# Altium project NUC973 DEV BOARD 20150401.PrjPcb
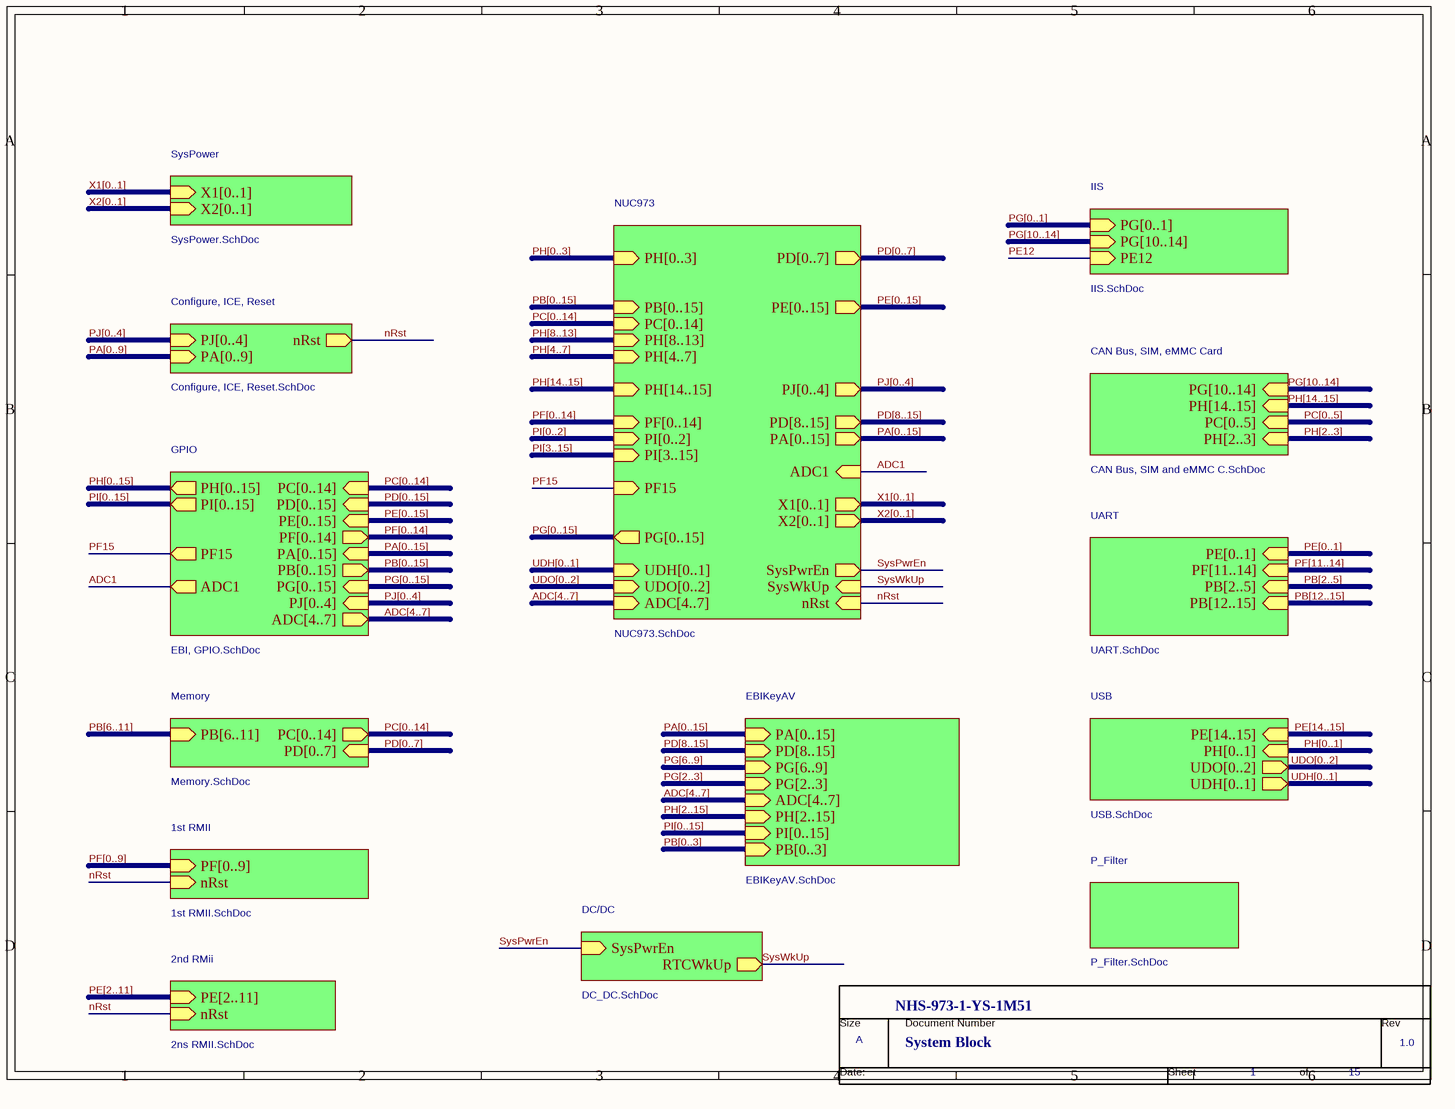
[diagram p0: SysBlock.SchDoc]
9 sheets, 369 parts. Net scope: hierarchical (ports join the sheet entries above them; power ports are global).
Sheets:
  SysBlock.SchDoc
    2nd RMii = 2ns RMII.SchDoc
    Memory = Memory.SchDoc
    USB = USB.SchDoc
    P_Filter = P_Filter.SchDoc
    SysPower = SysPower.SchDoc
    1st RMII = 1st RMII.SchDoc
    GPIO = EBI, GPIO.SchDoc
    IIS = IIS.SchDoc

## Sheet SysBlock.SchDoc
size 220 x 165 mm

### Parts
(Parts that share a designator on the sheet are numbered #1, #2 ... from top to bottom, then left to right.)
*#1  RevCode: 1.0  Page Size: A  Page Number: 1  Page Count: 15  Doc: System Block  OrgName: NHS-973-1-YS-1M51  (hidden comment: TitleBlock0N)  (graphical)

### Sub-sheets
1st RMII = 1st RMII.SchDoc: PF[0..9] (in), nRst (in)
2nd RMii = 2ns RMII.SchDoc: PE[2..11] (in), nRst (in)
CAN Bus, SIM, eMMC Card = CAN Bus, SIM and eMMC C.SchDoc (file not in this document): PG[10..14] (in), PH[14..15] (in), PH[2..3] (in), PC[0..5] (in)
Configure, ICE, Reset = Configure, ICE, Reset.SchDoc (file not in this document): PJ[0..4] (in), nRst (out), PA[0..9] (in)
DC/DC = DC_DC.SchDoc (file not in this document): SysPwrEn (in), RTCWkUp (out)
EBIKeyAV = EBIKeyAV.SchDoc (file not in this document): PA[0..15] (in), PD[8..15] (in), PG[6..9] (in), PG[2..3] (in), ADC[4..7] (in), PH[2..15] (in), PI[0..15] (in), PB[0..3] (in)
GPIO = EBI, GPIO.SchDoc: PC[0..14] (in), PD[0..15] (in), PE[0..15] (in), PF[0..14] (out), PH[0..15] (out), PA[0..15] (in), PB[0..15] (out), PG[0..15] (in), PI[0..15] (out), PJ[0..4] (in), ADC[4..7] (out), PF15 (out), ADC1 (out)
IIS = IIS.SchDoc: PG[0..1] (in), PG[10..14] (in), PE12 (in)
Memory = Memory.SchDoc: PB[6..11] (in), PC[0..14] (out), PD[0..7] (in)
NUC973 = NUC973.SchDoc (file not in this document): PD[0..7] (out), PH[0..3] (in), PE[0..15] (out), X1[0..1] (out), PB[0..15] (in), PC[0..14] (in), PH[8..13] (in), PH[4..7] (in), UDH[0..1] (in), PH[14..15] (in), UDO[0..2] (in), X2[0..1] (out), PF[0..14] (in), PI[0..2] (in), PI[3..15] (in), PJ[0..4] (out), nRst (in), PG[0..15] (out), PD[8..15] (out), PA[0..15] (out), SysWkUp (in), SysPwrEn (out), ADC[4..7] (in), PF15 (in), ADC1 (in)
P_Filter = P_Filter.SchDoc: no entries
SysPower = SysPower.SchDoc: X1[0..1] (in), X2[0..1] (in)
UART = UART.SchDoc (file not in this document): PE[0..1] (in), PF[11..14] (in), PB[2..5] (in), PB[12..15] (in)
USB = USB.SchDoc: PE[14..15] (in), UDO[0..2] (out), UDH[0..1] (out), PH[0..1] (in)

### Nets
ADC1: sheet NUC973/ADC1, sheet GPIO/ADC1
nRst: sheet 2nd RMii/nRst, sheet Configure, ICE, Reset/nRst, sheet NUC973/nRst, sheet 1st RMII/nRst
PE12: sheet IIS/PE12
PF15: sheet NUC973/PF15, sheet GPIO/PF15
SysPwrEn: sheet DC/DC/SysPwrEn, sheet NUC973/SysPwrEn
SysWkUp: sheet DC/DC/RTCWkUp, sheet NUC973/SysWkUp

### Buses and harness runs
bus ADC[4..7] = sheet EBIKeyAV/ADC[4..7]
bus ADC[4..7] = sheet GPIO/ADC[4..7]
bus ADC[4..7] = sheet NUC973/ADC[4..7]
bus PA[0..9] = sheet Configure, ICE, Reset/PA[0..9]
bus PA[0..15] = sheet EBIKeyAV/PA[0..15]
bus PA[0..15] = sheet GPIO/PA[0..15]
bus PA[0..15] = sheet NUC973/PA[0..15]
bus PB[0..3] = sheet EBIKeyAV/PB[0..3]
bus PB[0..15] = sheet GPIO/PB[0..15]
bus PB[0..15] = sheet NUC973/PB[0..15]
bus PB[2..5] = sheet UART/PB[2..5]
bus PB[6..11] = sheet Memory/PB[6..11]
bus PB[12..15] = sheet UART/PB[12..15]
bus PC[0..5] = sheet CAN Bus, SIM, eMMC Card/PC[0..5]
bus PC[0..14] = sheet GPIO/PC[0..14]
bus PC[0..14] = sheet Memory/PC[0..14]
bus PC[0..14] = sheet NUC973/PC[0..14]
bus PD[0..7] = sheet Memory/PD[0..7]
bus PD[0..7] = sheet NUC973/PD[0..7]
bus PD[0..15] = sheet GPIO/PD[0..15]
bus PD[8..15] = sheet EBIKeyAV/PD[8..15]
bus PD[8..15] = sheet NUC973/PD[8..15]
bus PE[0..1] = sheet UART/PE[0..1]
bus PE[0..15] = sheet GPIO/PE[0..15]
bus PE[0..15] = sheet NUC973/PE[0..15]
bus PE[2..11] = sheet 2nd RMii/PE[2..11]
bus PE[14..15] = sheet USB/PE[14..15]
bus PF[0..9] = sheet 1st RMII/PF[0..9]
bus PF[0..14] = sheet GPIO/PF[0..14]
bus PF[0..14] = sheet NUC973/PF[0..14]
bus PF[11..14] = sheet UART/PF[11..14]
bus PG[0..1] = sheet IIS/PG[0..1]
bus PG[0..15] = sheet GPIO/PG[0..15]
bus PG[0..15] = sheet NUC973/PG[0..15]
bus PG[2..3] = sheet EBIKeyAV/PG[2..3]
bus PG[6..9] = sheet EBIKeyAV/PG[6..9]
bus PG[10..14] = sheet CAN Bus, SIM, eMMC Card/PG[10..14]
bus PG[10..14] = sheet IIS/PG[10..14]
bus PH[0..1] = sheet USB/PH[0..1]
bus PH[0..3] = sheet NUC973/PH[0..3]
bus PH[0..15] = sheet GPIO/PH[0..15]
bus PH[2..3] = sheet CAN Bus, SIM, eMMC Card/PH[2..3]
bus PH[2..15] = sheet EBIKeyAV/PH[2..15]
bus PH[4..7] = sheet NUC973/PH[4..7]
bus PH[8..13] = sheet NUC973/PH[8..13]
bus PH[14..15] = sheet CAN Bus, SIM, eMMC Card/PH[14..15]
bus PH[14..15] = sheet NUC973/PH[14..15]
bus PI[0..2] = sheet NUC973/PI[0..2]
bus PI[0..15] = sheet EBIKeyAV/PI[0..15]
bus PI[0..15] = sheet GPIO/PI[0..15]
bus PI[3..15] = sheet NUC973/PI[3..15]
bus PJ[0..4] = sheet Configure, ICE, Reset/PJ[0..4]
bus PJ[0..4] = sheet GPIO/PJ[0..4]
bus PJ[0..4] = sheet NUC973/PJ[0..4]
bus UDH[0..1] = sheet NUC973/UDH[0..1]
bus UDH[0..1] = sheet USB/UDH[0..1]
bus UDO[0..2] = sheet NUC973/UDO[0..2]
bus UDO[0..2] = sheet USB/UDO[0..2]
bus X1[0..1] = sheet NUC973/X1[0..1]
bus X1[0..1] = sheet SysPower/X1[0..1]
bus X2[0..1] = sheet NUC973/X2[0..1]
bus X2[0..1] = sheet SysPower/X2[0..1]

### Notes on the sheet
- (in symbol TitleBlock0N) Size; Document Number; Rev; Date:; Sheet; of

### Library data of the parts
*#1 = TitleBlock0N: Page Create Date: April 25, 1995

## Sheet 2ns RMII.SchDoc
size 220 x 165 mm
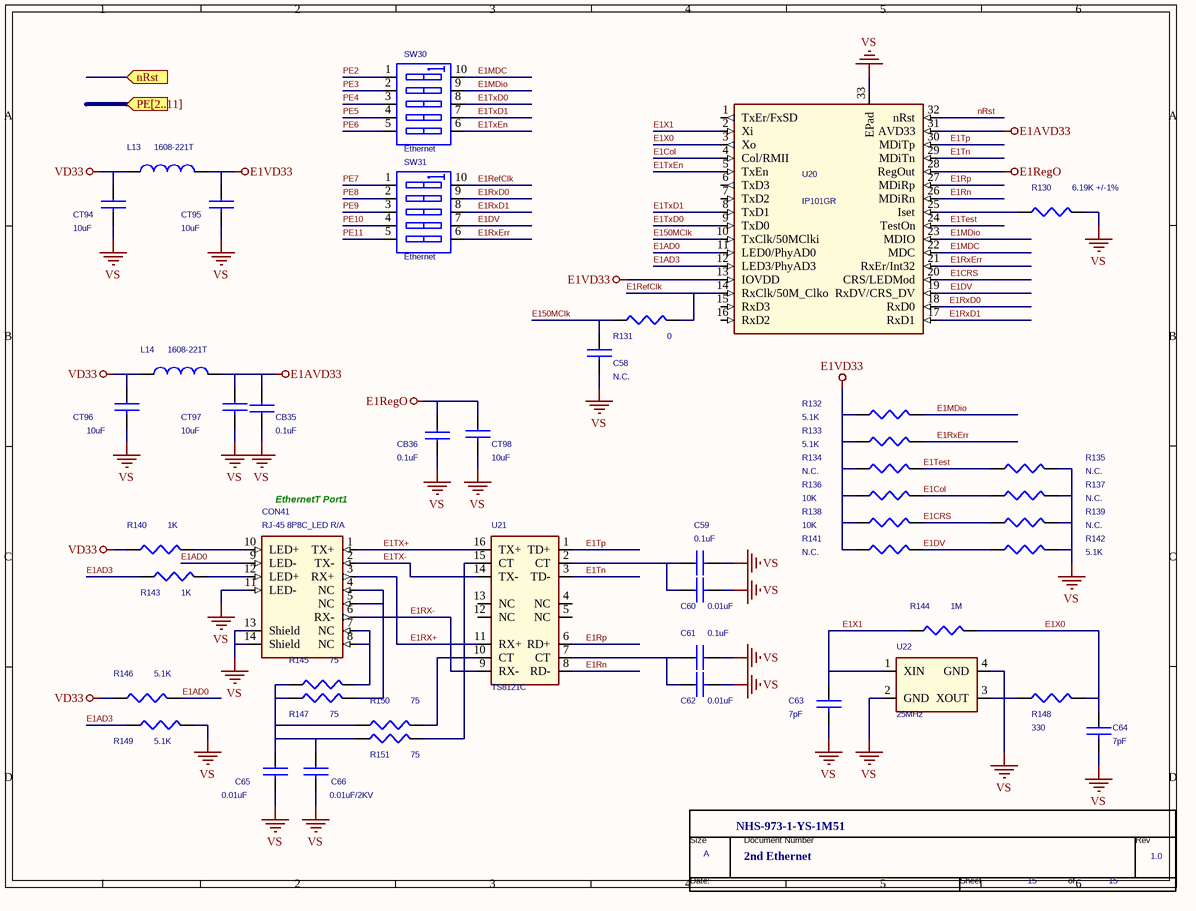
[diagram p1: 2ns RMII.SchDoc]

### Parts
(Parts that share a designator on the sheet are numbered #1, #2 ... from top to bottom, then left to right.)
*#2  RevCode: 1.0  Page Size: A  Page Number: 15  Doc: 2nd Ethernet  OrgName: NHS-973-1-YS-1M51  (hidden comment: TitleBlock0N)  (graphical)
C58  N.C.  [C0603]
C59  0.1uF  [C0603]
C60  0.01uF  [C0603]
C61  0.1uF  [C0603]
C62  0.01uF  [C0603]
C63  7pF  [C0603]
C64  7pF  [C0603]
C65  0.01uF  [C0603]
C66  0.01uF/2KV  [CK05]
CB35  0.1uF  [C0603]
CB36  0.1uF  [C0603]
CON41  RJ-45 8P8C_LED R/A  [RJ45\8P\JA\LED]
CT94  10uF  [C0603]
CT95  10uF  [C0603]
CT96  10uF  [C0603]
CT97  10uF  [C0603]
CT98  10uF  [C0603]
L13  1608-221T  [L0603]
L14  1608-221T  [L0603]
R130  6.19K +/-1%  [R0603]
R131  0  [R0603]
R132  5.1K  [R0603]
R133  5.1K  [R0603]
R134  N.C.  [R0603]
R135  N.C.  [R0603]
R136  10K  [R0603]
R137  N.C.  [R0603]
R138  10K  [R0603]
R139  N.C.  [R0603]
R140  1K  [R0603]
R141  N.C.  [R0603]
R142  5.1K  [R0603]
R143  1K  [R0603]
R144  1M  [R0603]
R145  75  [R0603]
R146  5.1K  [R0603]
R147  75  [R0603]
R148  330  [R0603]
R149  5.1K  [R0603]
R150  75  [R0603]
R151  75  [R0603]
SW30  Ethernet  [DIPSWx5_2.54mm]
SW31  Ethernet  [DIPSWx5_2.54mm]
U20  IP101GR  [QFN32]
U21  TS8121C  [ST6200T]
U22  25MHz  [SOT-143]

### Ports
nRst (in), PE[2..11] (in)

### Nets
E1AVD33: CB35.2 CT97.1 L14.2 U20.31(AVD33)
E1RegO: CB36.2 CT98.1 U20.28(RegOut)
E1VD33: CT95.1 L13.2 R132.2 R133.2 R134.2 R136.2 R138.2 R141.2 U20.13(IOVDD)
VD33: CT94.1 CT96.1 L13.1 L14.1 R140.1 R146.1
VS: C58.2 C59.2 C60.2 C61.2 C62.2 C63.2 C64.2 C65.2 C66.2 CB35.1 CB36.1 CON41.11(LED-) CON41.13(Shield) CON41.14(Shield) CT94.2 CT95.2 CT96.2 CT97.2 CT98.2 R130.1 R135.1 R137.1 R139.1 R142.1 R149.2 U20.33(EPad) U22.2(GND) U22.4(GND)
E1AD0: CON41.9(LED-) R146.2 U20.11(LED0/PhyAD0)
E1AD3: R143.1 R149.1 U20.12(LED3/PhyAD3)
E1Col: R136.1 R137.2 U20.4(Col/RMII)
E1CRS: R138.1 R139.2 U20.20(CRS/LEDMod)
E1DV: R141.1 R142.2 SW31.7(B4) U20.19(RxDV/CRS_DV)
E1MDC: SW30.10(B1) U20.22(MDC)
E1MDio: R132.1 SW30.9(B2) U20.23(MDIO)
E1RefClk: R131.1 SW31.10(B1) U20.14(RxClk/50M_Clko)
E1Rn: U20.26(MDiRn) U21.8(RD-)
E1Rp: U20.27(MDiRp) U21.6(RD+)
E1RX+: CON41.3(RX+) U21.11(RX+)
E1RX-: CON41.6(RX-) U21.9(RX-)
E1RxD0: SW31.9(B2) U20.18(RxD0)
E1RxD1: SW31.8(B3) U20.17(RxD1)
E1RxErr: R133.1 SW31.6(B5) U20.21(RxEr/Int32)
E1Test: R134.1 R135.2 U20.24(TestOn)
E1Tn: U20.29(MDiTn) U21.3(TD-)
E1Tp: U20.30(MDiTp) U21.1(TD+)
E1TX+: CON41.1(TX+) U21.16(TX+)
E1TX-: CON41.2(TX-) U21.14(TX-)
E1TxD0: SW30.8(B3) U20.9(TxD0)
E1TxD1: SW30.7(B4) U20.8(TxD1)
E1TxEn: SW30.6(B5) U20.5(TxEn)
E1X0: C64.1 R144.1 R148.2 U20.3(Xo)
E1X1: C63.1 R144.2 U20.2(Xi) U22.1(XIN)
E150MClk: C58.1 R131.2 U20.10(TxClk/50MClki)
nRst: U20.32(nRst)
PE2: SW30.1(A1)
PE3: SW30.2(A2)
PE4: SW30.3(A3)
PE5: SW30.4(A4)
PE6: SW30.5(A5)
PE7: SW31.1(A1)
PE8: SW31.2(A2)
PE9: SW31.3(A3)
PE10: SW31.4(A4)
PE11: SW31.5(A5)
NetC59_1: C59.1 C60.1 U21.2(CT)
NetC61_1: C61.1 C62.1 U21.7(CT)
NetC65_1: C65.1 C66.1 R145.1 R147.1 R150.1 R151.1
NetCON41_4: CON41.4(NC) CON41.5(NC) R147.2
NetCON41_7: CON41.7(NC) CON41.8(NC) R145.2
NetCON41_10: CON41.10(LED+) R140.2
NetCON41_12: CON41.12(LED+) R143.2
NetR130_2: R130.2 U20.25(Iset)
NetR148_1: R148.1 U22.3(XOUT)
NetR150_2: R150.2 U21.10(CT)
NetR151_2: R151.2 U21.15(CT)

Not connected (* = marked no-connect by the designer): U20 1(TxEr/FxSD) 6(TxD3) 7(TxD2) 15(RxD3) 16(RxD2); U21 4(NC) 5(NC) 12(NC) 13(NC)

### Notes on the sheet
- (near CON41) EthernetT Port1
- (in symbol TitleBlock0N) Size; Document Number; Rev; Date:; Sheet; of

### Library data of the parts
C58-C66 CB35 CB36 CT94-CT98 = CAP NP
CON41 = RJ45_SHLD_0
L13 L14 = INDUCTOR
R130-R151 = R
SW30 SW31 = SW DIP-5_0
U20 = IP101GA_0
U21 = PE-68515_1
U22 = Crystal_SMD_2: Vendor: Aurum
*#2 = TitleBlock0N: Page Create Date: April 25, 1995; Page Count: 15

## Sheet Memory.SchDoc
size 220 x 165 mm
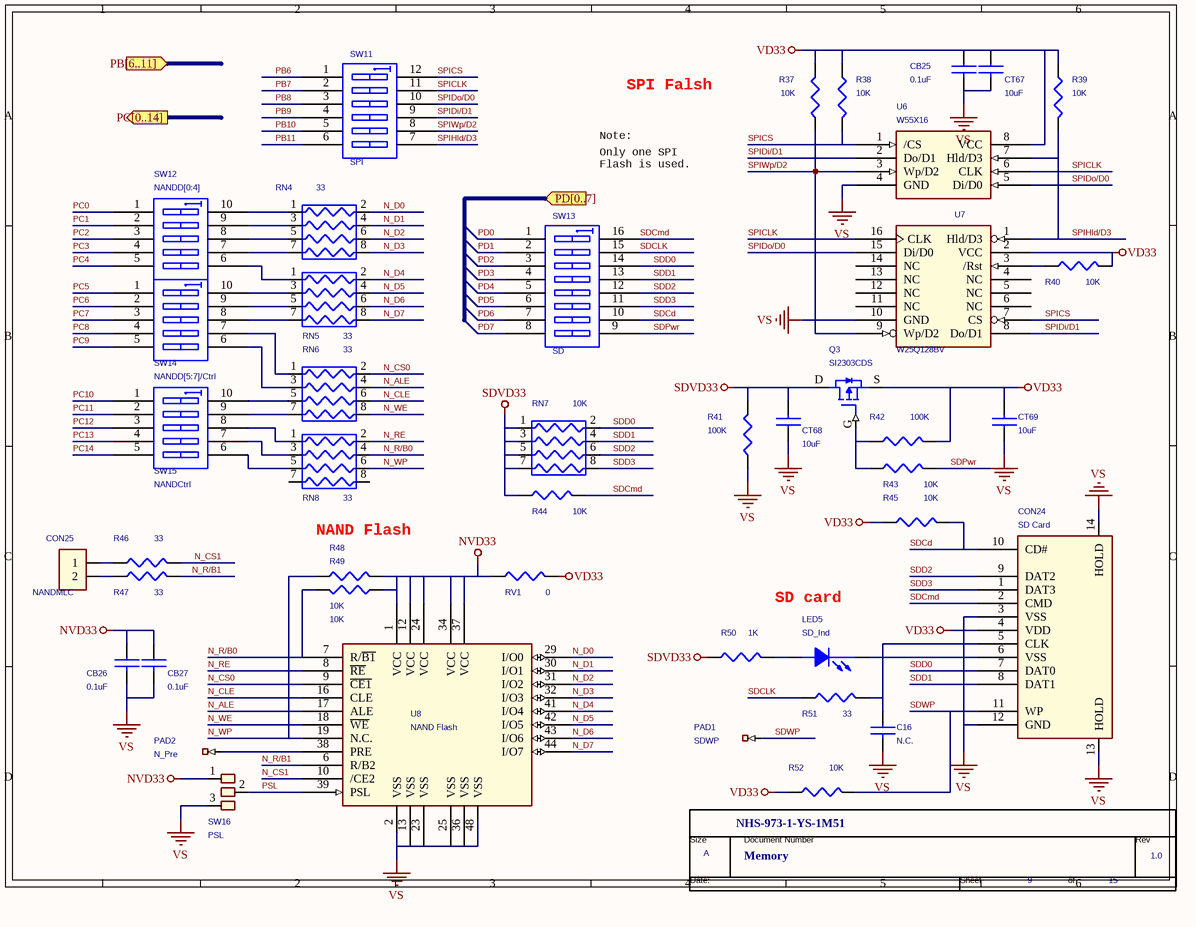
[diagram p2: Memory.SchDoc]

### Parts
(Parts that share a designator on the sheet are numbered #1, #2 ... from top to bottom, then left to right.)
*#3  RevCode: 1.0  Page Size: A  Page Number: 9  Page Count: 15  Doc: Memory  OrgName: NHS-973-1-YS-1M51  (hidden comment: TitleBlock0N)  (graphical)
C16  N.C.  [C0603]
CB25  0.1uF  [C0603]
CB26  0.1uF  [C0603]
CB27  0.1uF  [C0603]
CON24  SD Card  [AXA2R63061]
CON25  NANDMLC  [Header_2x1_2.54mm]
CT67  10uF  [C0603]
CT68  10uF  [C0603]
CT69  10uF  [C0603]
LED5  SD_Ind  [LED_0603]
PAD1  SDWP  [1PAD 1.25x1.25mm]
PAD2  N_Pre  [1PAD 1.25x1.25mm]
Q3  SI2303CDS  [SOT-23]
R37  10K  [R0603]
R38  10K  [R0603]
R39  10K  [R0603]
R40  10K  [R0603]
R41  100K  [R0603]
R42  100K  [R0603]
R43  10K  [R0603]
R44  10K  [R0603]
R45  10K  [R0603]
R46  33  [R0603]
R47  33  [R0603]
R48  10K  [R0603]
R49  10K  [R0603]
R50  1K  [R0603]
R51  33  [R0603]
R52  10K  [R0603]
RN4  33  [8P4RA]
RN5  33  [8P4RA]
RN6  33  [8P4RA]
RN7  10K  [8P4RA]
RN8  33  [8P4RA]
RV1  0  [R0603]
SW11  SPI  [DIPSWx6_2.54mm]
SW12  NANDD[0:4]  [DIPSWx5_2.54mm]
SW13  SD  [DIPSWx8_2.54mm]
SW14  NANDD[5:7]/Ctrl  [DIPSWx5_2.54mm]
SW15  NANDCtrl  [DIPSWx5_2.54mm]
SW16  PSL  [3P-1.2mm]
U6  W55X16  [8-pin SOIC 150mil]
U7  W25Q128BV  [SOIC16_300]
U8  NAND Flash  [SOP48-0.5mm]

### Ports
PB[6..11] (in), PC[0..14] (out), PD[0..7] (in)

### Nets
NVD33: CB26.1 CB27.1 R48.2 R49.2 RV1.2 SW16.1(\) U8.1(VCC) U8.12(VCC) U8.24(VCC) U8.34(VCC) U8.37(VCC)
SDVD33: CT68.2 Q3.D(DRAIN) R41.2 R44.2 R50.1 RN7.1(R1) RN7.3(R2) RN7.5(R3) RN7.7(R4)
VD33: CB25.1 CON24.4(VDD) CT67.1 CT69.2 Q3.S(SOURCE) R37.2 R38.2 R39.2 R40.1 R42.2 R45.2 R52.2 RV1.1 U6.8(VCC) U7.2(VCC)
VS: C16.2 CB25.2 CB26.2 CB27.2 CON24.3(VSS) CON24.12(GND) CON24.13(HOLD) CON24.14(HOLD) CT67.2 CT68.1 CT69.1 R41.1 SW16.3(\) U6.4(GND) U7.10(GND) U8.2(VSS) U8.13(VSS) U8.23(VSS) U8.25(VSS) U8.36(VSS) U8.48(VSS)
N_ALE: RN6.4(R2) U8.17(ALE)
N_CLE: RN6.6(R3) U8.16(CLE)
N_CS0: RN6.2(R1) U8.9(~{CE1})
N_CS1: R46.2 U8.10(/CE2)
N_D0: RN4.2(R1) U8.29(I/O0)
N_D1: RN4.4(R2) U8.30(I/O1)
N_D2: RN4.6(R3) U8.31(I/O2)
N_D3: RN4.8(R4) U8.32(I/O3)
N_D4: RN5.2(R1) U8.41(I/O4)
N_D5: RN5.4(R2) U8.42(I/O5)
N_D6: RN5.6(R3) U8.43(I/O6)
N_D7: RN5.8(R4) U8.44(I/O7)
N_R/B0: R49.1 RN8.4(R2) U8.7(R/~{B1})
N_R/B1: R47.2 U8.6(R/B2)
N_RE: RN8.2(R1) U8.8(~{RE})
N_WE: RN6.8(R4) U8.18(~{WE})
N_WP: R48.1 RN8.6(R3) U8.19(N.C.)
PB6: SW11.1(A1)
PB7: SW11.2(A2)
PB8: SW11.3(A3)
PB9: SW11.4(A4)
PB10: SW11.5(A5)
PB11: SW11.6(A6)
PC0: SW12.1(A1)
PC1: SW12.2(A2)
PC2: SW12.3(A3)
PC3: SW12.4(A4)
PC4: SW12.5(A5)
PC5: SW14.1(A1)
PC6: SW14.2(A2)
PC7: SW14.3(A3)
PC8: SW14.4(A4)
PC9: SW14.5(A5)
PC10: SW15.1(A1)
PC11: SW15.2(A2)
PC12: SW15.3(A3)
PC13: SW15.4(A4)
PC14: SW15.5(A5)
PD0: SW13.1(A1)
PD1: SW13.2(A2)
PD2: SW13.3(A3)
PD3: SW13.4(A4)
PD4: SW13.5(A5)
PD5: SW13.6(A6)
PD6: SW13.7(A7)
PD7: SW13.8(A8)
PSL: SW16.2(\) U8.39(PSL)
SDCd: CON24.10(CD#) R45.1 SW13.10(B7)
SDCLK: R51.2 SW13.15(B2)
SDCmd: CON24.2(CMD) R44.1 SW13.16(B1)
SDD0: CON24.7(DAT0) RN7.2(R1) SW13.14(B3)
SDD1: CON24.8(DAT1) RN7.4(R2) SW13.13(B4)
SDD2: CON24.9(DAT2) RN7.6(R3) SW13.12(B5)
SDD3: CON24.1(DAT3) RN7.8(R4) SW13.11(B6)
SDPwr: R43.1 SW13.9(B8)
SDWP: CON24.11(WP) PAD1.\ R52.1
SPICLK: SW11.11(B2) U6.6(CLK) U7.16(CLK)
SPICS: R38.1 SW11.12(B1) U6.1(/CS) U7.7(CS)
SPIDi/D1: SW11.9(B4) U6.2(Do/D1) U7.8(Do/D1)
SPIDo/D0: SW11.10(B3) U6.5(Di/D0) U7.15(Di/D0)
SPIHld/D3: R39.1 SW11.7(B6) U6.7(Hld/D3) U7.1(Hld/D3)
SPIWp/D2: R37.1 SW11.8(B5) U6.3(Wp/D2) U7.9(Wp/D2)
NetC16_1: C16.1 CON24.5(CLK) R51.1
NetCON24_6: CON24.6(VSS) LED5.2(CATHODE)
NetCON25_1: CON25.1 R46.1
NetCON25_2: CON25.2 R47.1
NetLED5_1: LED5.1(ANODE) R50.2
NetPAD2~{_}: PAD2.\ U8.38(PRE)
NetQ3_G: Q3.G(GATE) R42.1 R43.2
NetR40_2: R40.2 U7.3(/Rst)
NetRN4_1: RN4.1(R1) SW12.10(B1)
NetRN4_3: RN4.3(R2) SW12.9(B2)
NetRN4_5: RN4.5(R3) SW12.8(B3)
NetRN4_7: RN4.7(R4) SW12.7(B4)
NetRN5_1: RN5.1(R1) SW12.6(B5)
NetRN5_3: RN5.3(R2) SW14.10(B1)
NetRN5_5: RN5.5(R3) SW14.9(B2)
NetRN5_7: RN5.7(R4) SW14.8(B3)
NetRN6_1: RN6.1(R1) SW14.7(B4)
NetRN6_3: RN6.3(R2) SW14.6(B5)
NetRN6_5: RN6.5(R3) SW15.10(B1)
NetRN6_7: RN6.7(R4) SW15.9(B2)
NetRN8_1: RN8.1(R1) SW15.8(B3)
NetRN8_3: RN8.3(R2) SW15.7(B4)
NetRN8_5: RN8.5(R3) SW15.6(B5)

Not connected (* = marked no-connect by the designer): RN8 7(R4) 8(R4); U7 4(NC) 5(NC) 6(NC) 11(NC) 12(NC) 13(NC) 14(NC)

### Notes on the sheet
- SPI Falsh
- Only one SPI
  Flash is used.
- Note:
- NAND Flash
- SD card
- (in symbol TitleBlock0N) Size; Document Number; Rev; Date:; Sheet; of

### Library data of the parts
C16 CB25-CB27 CT67-CT69 = CAP NP
CON24 = AXA2R63061_1
CON25 = CON2
LED5 = LED
PAD1 PAD2 = 1PAD
Q3 = SI2303CDS_1
R37-R52 RV1 = R
RN4-RN8 = R-PACK8_0: Package: 8P4RA
SW11 = SW DIP-6
SW12 SW14 SW15 = SW DIP-5
SW13 = SW DIP-8
SW16 = SW-3PAD2
U6 = W55X10_2
U7 = W25Q128BV_4
U8 = NAND 4-8G_0
*#3 = TitleBlock0N: Page Create Date: April 25, 1995

## Sheet USB.SchDoc
size 220 x 165 mm
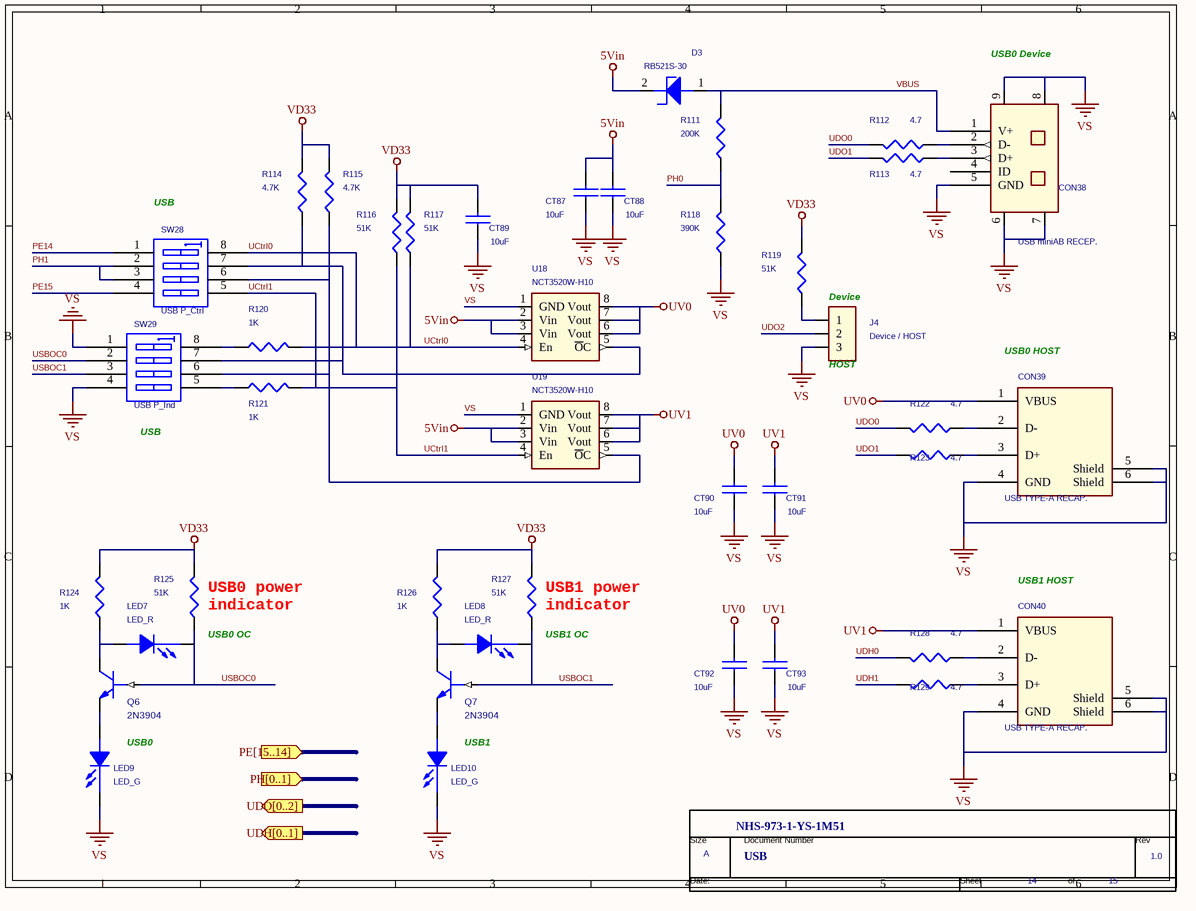
[diagram p3: USB.SchDoc]

### Parts
(Parts that share a designator on the sheet are numbered #1, #2 ... from top to bottom, then left to right.)
*#4  RevCode: 1.0  Page Size: A  Page Number: 14  Page Count: 15  Doc: USB  OrgName: NHS-973-1-YS-1M51  (hidden comment: TitleBlock0N)  (graphical)
CON38  USB miniAB RECEP.  [9]
CON39  USB TYPE-A RECAP.  [USB4P]
CON40  USB TYPE-A RECAP.  [USB4P]
CT87  10uF  [C0603]
CT88  10uF  [C0603]
CT89  10uF  [C0603]
CT90  10uF  [C0603]
CT91  10uF  [C0603]
CT92  10uF  [C0603]
CT93  10uF  [C0603]
D3  RB521S-30  [SOD-523]
J4  Device / HOST  [Header_3x1_2.54mm]
LED7  LED_R  [LED_0603]
LED8  LED_R  [LED_0603]
LED9  LED_G  [LED_0603]
LED10  LED_G  [LED_0603]
Q6  2N3904  [SOT23-BEC]
Q7  2N3904  [SOT23-BEC]
R111  200K  [R0603]
R112  4.7  [R0603]
R113  4.7  [R0603]
R114  4.7K  [R0603]
R115  4.7K  [R0603]
R116  51K  [R0603]
R117  51K  [R0603]
R118  390K  [R0603]
R119  51K  [R0603]
R120  1K  [R0603]
R121  1K  [R0603]
R122  4.7  [R0603]
R123  4.7  [R0603]
R124  1K  [R0603]
R125  51K  [R0603]
R126  1K  [R0603]
R127  51K  [R0603]
R128  4.7  [R0603]
R129  4.7  [R0603]
SW28  USB P_Ctrl  [DIPSWx4_2.54mm]
SW29  USB P_Ind  [DIPSWx4_2.54mm]
U18  NCT3520W-H10  [MSOP-8]
U19  NCT3520W-H10  [MSOP-8]

### Ports
PE[15..14] (in), PH[0..1] (in), UDH[0..1] (out), UDO[0..2] (out)

### Nets
5Vin: CT87.2 CT88.2 D3.2 U18.2(Vin) U18.3(Vin) U19.2(Vin) U19.3(Vin)
UV0: CON39.1(VBUS) CT90.2 CT92.2 U18.6(Vout) U18.7(Vout) U18.8(Vout)
UV1: CON40.1(VBUS) CT91.2 CT93.2 U19.6(Vout) U19.7(Vout) U19.8(Vout)
VD33: CT89.2 R114.2 R115.2 R116.2 R117.2 R119.2 R124.2 R125.2 R126.2 R127.2
VS: CON38.5(GND) CON38.6(\) CON38.7(\) CON38.8(\) CON38.9(\) CON39.4(GND) CON39.5(Shield) CON39.6(Shield) CON40.4(GND) CON40.5(Shield) CON40.6(Shield) CT87.1 CT88.1 CT89.1 CT90.1 CT91.1 CT92.1 CT93.1 J4.3 LED9.2(CATHODE) LED10.2(CATHODE) R118.1 SW29.1(A1) SW29.4(A4) U18.1(GND) U19.1(GND)
PE14: SW28.1(A1)
PE15: SW28.4(A4)
PH0: R111.1 R118.2
PH1: SW28.2(A2) SW28.3(A3)
UCtrl0: R117.1 R120.1 SW28.8(B1) U18.4(En)
UCtrl1: R116.1 R121.1 SW28.5(B4) U19.4(En)
UDH0: R128.2
UDH1: R129.2
UDO0: R112.2 R122.2
UDO1: R113.2 R123.2
UDO2: J4.2
USBOC0: LED7.2(CATHODE) Q6.B R125.1 SW29.2(A2)
USBOC1: LED8.2(CATHODE) Q7.B R127.1 SW29.3(A3)
VBUS: CON38.1(V+) D3.1 R111.2
NetCON38_2: CON38.2(D-) R112.1
NetCON38_3: CON38.3(D+) R113.1
NetCON39_2: CON39.2(D-) R122.1
NetCON39_3: CON39.3(D+) R123.1
NetCON40_2: CON40.2(D-) R128.1
NetCON40_3: CON40.3(D+) R129.1
NetJ4_1: J4.1 R119.1
NetLED7_1: LED7.1(ANODE) Q6.C R124.1
NetLED8_1: LED8.1(ANODE) Q7.C R126.1
NetLED9_1: LED9.1(ANODE) Q6.E
NetLED10_1: LED10.1(ANODE) Q7.E
NetR114_1: R114.1 SW28.7(B2) SW29.7(B2) U18.5(~{O}C)
NetR115_1: R115.1 SW28.6(B3) SW29.6(B3) U19.5(~{O}C)
NetR120_2: R120.2 SW29.8(B1)
NetR121_2: R121.2 SW29.5(B4)

Not connected (* = marked no-connect by the designer): CON38 4(ID)

### Notes on the sheet
- (near CON38) USB0 Device
- (near SW28) USB
- Device
- (near J4) HOST
- (near CON39) USB0 HOST
- (near SW29) USB
- (near R125) USB0 power
  indicator
- (near R127) USB1 power
  indicator
- USB0 OC
- USB1 OC
- (near CON40) USB1 HOST
- USB0
- USB1
- (in symbol TitleBlock0N) Size; Document Number; Rev; Date:; Sheet; of

### Library data of the parts
CON38 = USB Type B_0
CON39 CON40 = USB type_A connector
CT87-CT93 = CAP NP
D3 = ZENAR_0: Package: D
J4 = CON3
LED7-LED10 = LED
Q6 Q7 = NPN_1
R111-R129 = R
SW28 = SW DIP-4_4
SW29 = SW DIP-4
*#4 = TitleBlock0N: Page Create Date: April 25, 1995

## Sheet P_Filter.SchDoc
size 220 x 165 mm
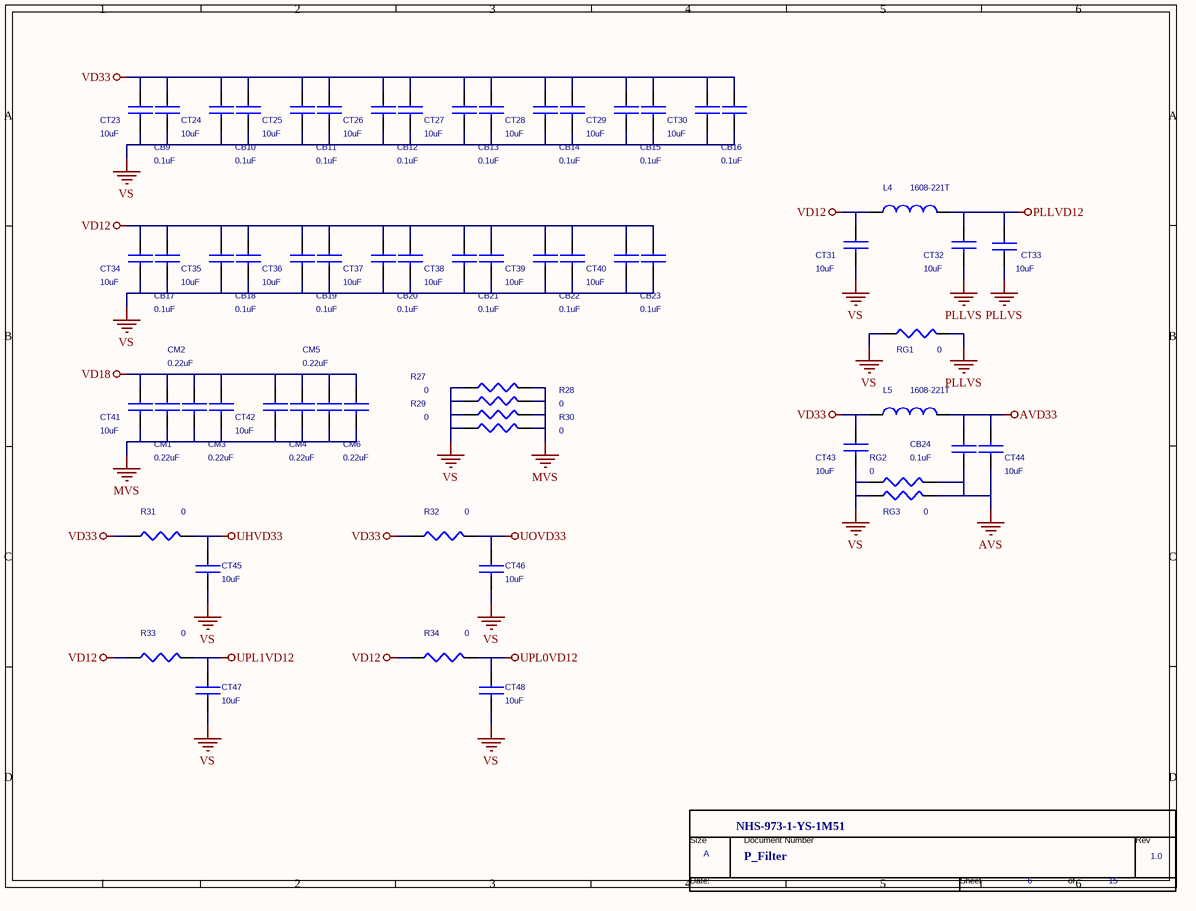
[diagram p4: P_Filter.SchDoc]

### Parts
(Parts that share a designator on the sheet are numbered #1, #2 ... from top to bottom, then left to right.)
*#5  RevCode: 1.0  Page Size: A  Page Number: 6  Page Count: 15  Doc: P_Filter  OrgName: NHS-973-1-YS-1M51  (hidden comment: TitleBlock0N)  (graphical)
CB9  0.1uF  [C0603]
CB10  0.1uF  [C0603]
CB11  0.1uF  [C0603]
CB12  0.1uF  [C0603]
CB13  0.1uF  [C0603]
CB14  0.1uF  [C0603]
CB15  0.1uF  [C0603]
CB16  0.1uF  [C0603]
CB17  0.1uF  [C0603]
CB18  0.1uF  [C0603]
CB19  0.1uF  [C0603]
CB20  0.1uF  [C0603]
CB21  0.1uF  [C0603]
CB22  0.1uF  [C0603]
CB23  0.1uF  [C0603]
CB24  0.1uF  [C0603]
CM1  0.22uF  [C0603]
CM2  0.22uF  [C0603]
CM3  0.22uF  [C0603]
CM4  0.22uF  [C0603]
CM5  0.22uF  [C0603]
CM6  0.22uF  [C0603]
CT23  10uF  [C0603]
CT24  10uF  [C0603]
CT25  10uF  [C0603]
CT26  10uF  [C0603]
CT27  10uF  [C0603]
CT28  10uF  [C0603]
CT29  10uF  [C0603]
CT30  10uF  [C0603]
CT31  10uF  [C0603]
CT32  10uF  [C0603]
CT33  10uF  [C0603]
CT34  10uF  [C0603]
CT35  10uF  [C0603]
CT36  10uF  [C0603]
CT37  10uF  [C0603]
CT38  10uF  [C0603]
CT39  10uF  [C0603]
CT40  10uF  [C0603]
CT41  10uF  [C0603]
CT42  10uF  [C0603]
CT43  10uF  [C0603]
CT44  10uF  [C0603]
CT45  10uF  [C0603]
CT46  10uF  [C0603]
CT47  10uF  [C0603]
CT48  10uF  [C0603]
L4  1608-221T  [L0603]
L5  1608-221T  [L0603]
R27  0  [R0603]
R28  0  [R0603]
R29  0  [R0603]
R30  0  [R0603]
R31  0  [R0603]
R32  0  [R0603]
R33  0  [R0603]
R34  0  [R0603]
RG1  0  [R0603]
RG2  0  [R0603]
RG3  0  [R0603]

### Nets
AVD33: CB24.2 CT44.2 L5.2
AVS: CB24.1 CT44.1 RG2.2 RG3.2
MVS: CM1.2 CM2.2 CM3.2 CM4.2 CM5.2 CM6.2 CT41.2 CT42.2 R27.1 R28.1 R29.1 R30.1
PLLVD12: CT32.1 CT33.2 L4.2
PLLVS: CT32.2 CT33.1 RG1.2
UHVD33: CT45.1 R31.1
UOVD33: CT46.1 R32.1
UPL0VD12: CT48.1 R34.1
UPL1VD12: CT47.1 R33.1
VD12: CB17.1 CB18.1 CB19.1 CB20.1 CB21.1 CB22.1 CB23.1 CT31.1 CT34.1 CT35.1 CT36.1 CT37.1 CT38.1 CT39.1 CT40.1 L4.1 R33.2 R34.2
VD18: CM1.1 CM2.1 CM3.1 CM4.1 CM5.1 CM6.1 CT41.1 CT42.1
VD33: CB9.1 CB10.1 CB11.1 CB12.1 CB13.1 CB14.1 CB15.1 CB16.1 CT23.1 CT24.1 CT25.1 CT26.1 CT27.1 CT28.1 CT29.1 CT30.1 CT43.1 L5.1 R31.2 R32.2
VS: CB9.2 CB10.2 CB11.2 CB12.2 CB13.2 CB14.2 CB15.2 CB16.2 CB17.2 CB18.2 CB19.2 CB20.2 CB21.2 CB22.2 CB23.2 CT23.2 CT24.2 CT25.2 CT26.2 CT27.2 CT28.2 CT29.2 CT30.2 CT31.2 CT34.2 CT35.2 CT36.2 CT37.2 CT38.2 CT39.2 CT40.2 CT43.2 CT45.2 CT46.2 CT47.2 CT48.2 R27.2 R28.2 R29.2 R30.2 RG1.1 RG2.1 RG3.1

### Notes on the sheet
- (in symbol TitleBlock0N) Size; Document Number; Rev; Date:; Sheet; of

### Library data of the parts
CB9-CB24 CM1-CM6 CT23-CT48 = CAP NP
L4 L5 = INDUCTOR
R27-R34 RG1-RG3 = R
*#5 = TitleBlock0N: Page Create Date: April 25, 1995

## Sheet SysPower.SchDoc
size 220 x 165 mm
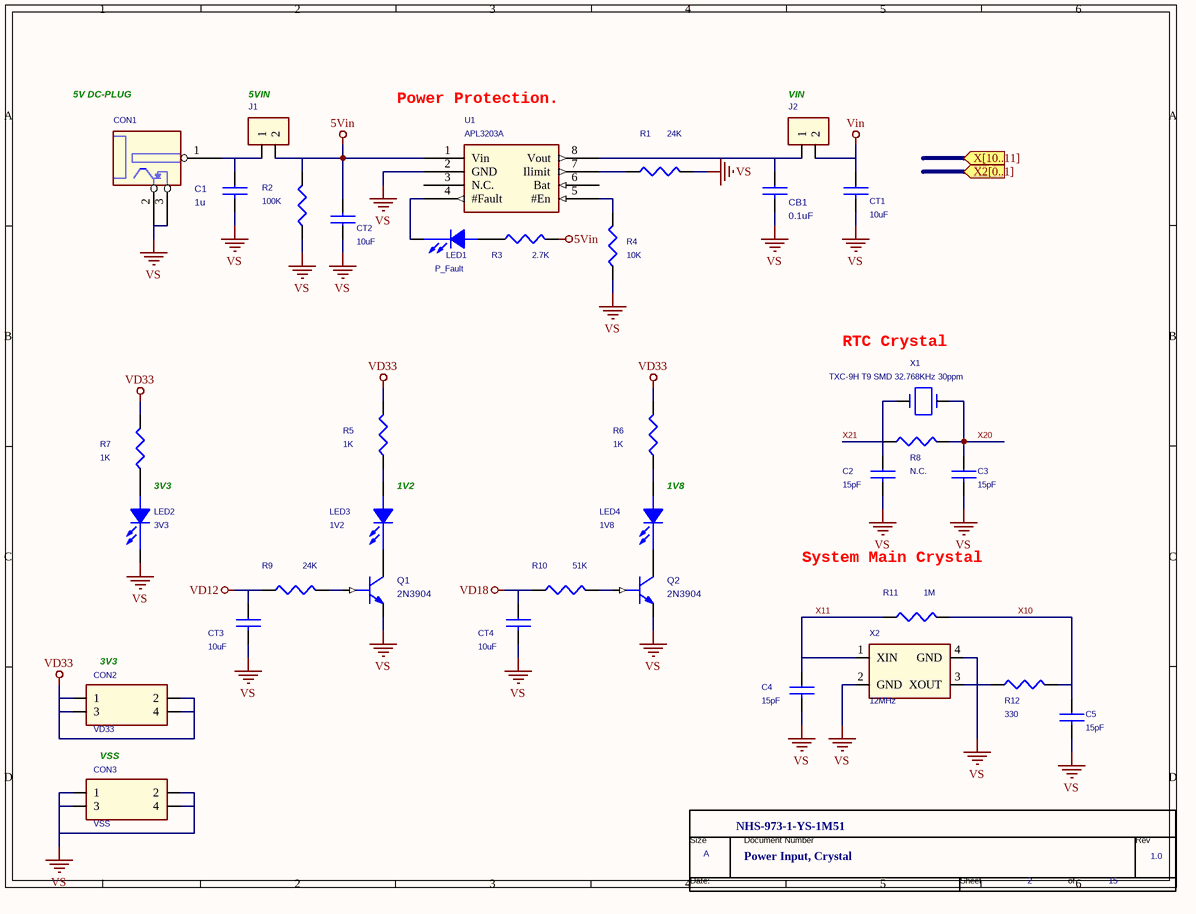
[diagram p5: SysPower.SchDoc]

### Parts
(Parts that share a designator on the sheet are numbered #1, #2 ... from top to bottom, then left to right.)
*#6  RevCode: 1.0  Page Size: A  Page Number: 2  Page Count: 15  Doc: Power Input, Crystal  OrgName: NHS-973-1-YS-1M51  (hidden comment: TitleBlock0N)  (graphical)
C1  1u  [C0603]
C2  15pF  [C0603]
C3  15pF  [C0603]
C4  15pF  [C0603]
C5  15pF  [C0603]
CB1  0.1uF  [C0603]
CON1  DC-PLUG  [3]  (value not drawn)
CON2  VD33  [Header_2x2_2.54mm]
CON3  VSS  [Header_2x2_2.54mm]
CT1  10uF  [C0603]
CT2  10uF  [C0603]
CT3  10uF  [C0603]
CT4  10uF  [C0603]
J1  5Vin  [Header_2x1_2.54mm]  (value not drawn)
J2  Vin  [Header_2x1_2.54mm]  (value not drawn)
LED1  P_Fault  [LED_0603]
LED2  3V3  [LED_0603]
LED3  1V2  [LED_0603]
LED4  1V8  [LED_0603]
Q1  2N3904  [SOT23-BEC]
Q2  2N3904  [SOT23-BEC]
R1  24K  [R0603]
R2  100K  [R0603]
R3  2.7K  [R0603]
R4  10K  [R0603]
R5  1K  [R0603]
R6  1K  [R0603]
R7  1K  [R0603]
R8  N.C.  [R0603]
R9  24K  [R0603]
R10  51K  [R0603]
R11  1M  [R0603]
R12  330  [R0603]
U1  APL3203A  [TDFN2x2-8]
X1  TXC-9H T9 SMD 32.768KHz 30ppm  [XTAL_2P/1.5mm]
X2  12MHz  [TXC7m-3.2x2.5mm]

### Ports
X2[0..1] (in), X[10..11] (in)

### Nets
5Vin: CT2.2 J1.2 R2.2 R3.2 U1.1(Vin)
VD12: CT3.1 R9.2
VD18: CT4.1 R10.2
VD33: CON2.1 CON2.2 CON2.3 CON2.4 R5.2 R6.2 R7.2
Vin: CT1.1 J2.2
VS: C1.2 C2.2 C3.2 C4.2 C5.2 CB1.2 CON1.2 CON1.3 CON3.1 CON3.2 CON3.3 CON3.4 CT1.2 CT2.1 CT3.2 CT4.2 LED2.2(CATHODE) Q1.E Q2.E R1.1 R2.1 R4.2 U1.2(GND) X2.2(GND) X2.4(GND)
X10: C5.1 R11.1 R12.2
X11: C4.1 R11.2 X2.1(XIN)
X20: C3.1 R8.1 X1.1
X21: C2.1 R8.2 X1.2
NetC1_1: C1.1 CON1.1 J1.1
NetCB1_1: CB1.1 J2.1 U1.8(Vout)
NetLED1_1: LED1.1(ANODE) R3.1
NetLED1_2: LED1.2(CATHODE) U1.4(#Fault)
NetLED2_1: LED2.1(ANODE) R7.1
NetLED3_1: LED3.1(ANODE) R5.1
NetLED3_2: LED3.2(CATHODE) Q1.C
NetLED4_1: LED4.1(ANODE) R6.1
NetLED4_2: LED4.2(CATHODE) Q2.C
NetQ1_B: Q1.B R9.1
NetQ2_B: Q2.B R10.1
NetR1_2: R1.2 U1.7(Ilimit)
NetR4_1: R4.1 U1.5(#En)
NetR12_1: R12.1 X2.3(XOUT)

Not connected (* = marked no-connect by the designer): U1 3(N.C.) 6(Bat)

### Notes on the sheet
- 5V DC-PLUG
- (near J1) 5VIN
- (near U1) Power Protection.
- (near J2) VIN
- (near X1) RTC Crystal
- 3V3
- (near LED3) 1V2
- (near LED4) 1V8
- System Main Crystal
- (near CON2) 3V3
- VSS
- (in symbol TitleBlock0N) Size; Document Number; Rev; Date:; Sheet; of

### Library data of the parts
C1-C5 CB1 CT1-CT4 = CAP NP
CON1 = Power Jack
CON2 CON3 = CON4A
J1 J2 = CON2
LED1-LED4 = LED
Q1 Q2 = NPN_1
R1-R12 = R
U1 = APL3203A_1
X1 = MA306/SM_2: Vendor: TXC
X2 = Crystal_SMD_2
*#6 = TitleBlock0N: Page Create Date: April 25, 1995

## Sheet 1st RMII.SchDoc
size 220 x 165 mm
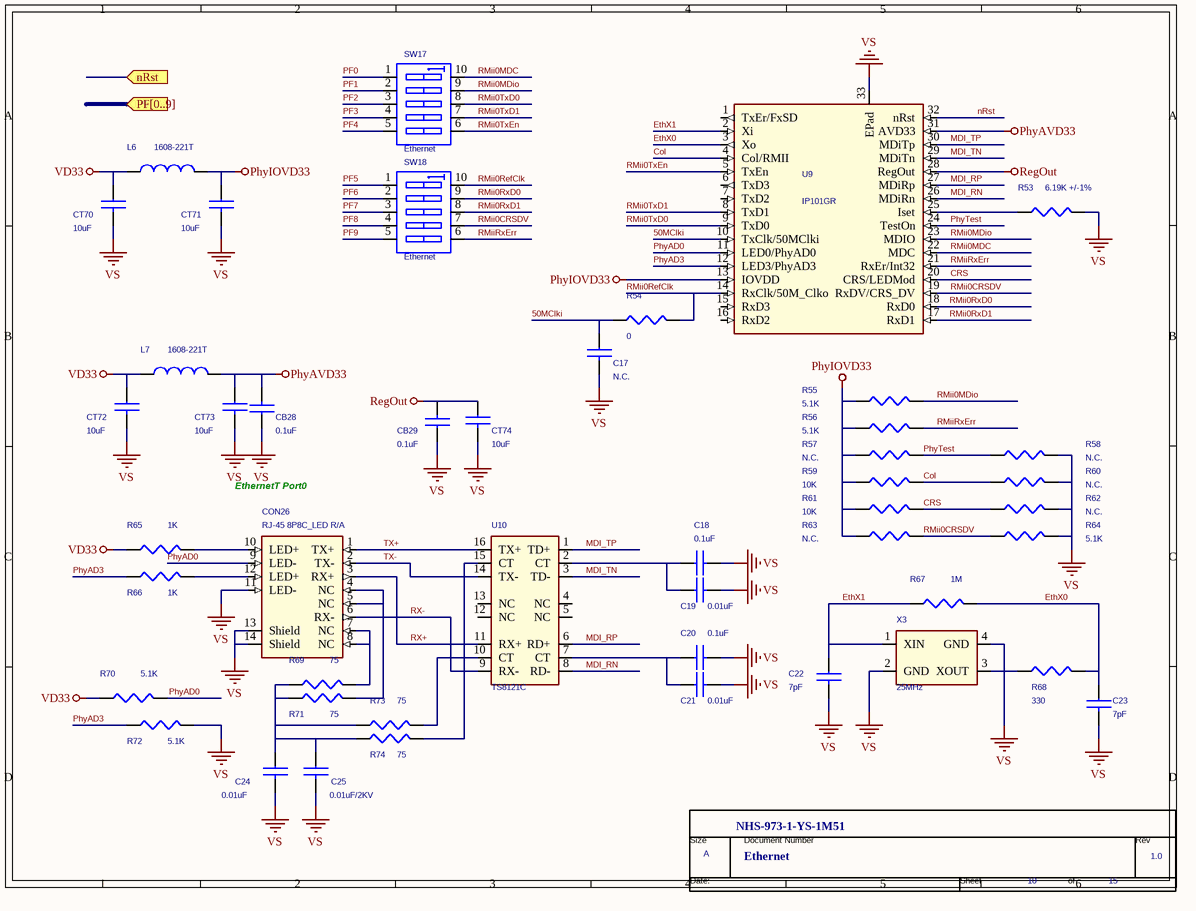
[diagram p6: 1st RMII.SchDoc]

### Parts
(Parts that share a designator on the sheet are numbered #1, #2 ... from top to bottom, then left to right.)
*#7  RevCode: 1.0  Page Size: A  Page Number: 10  Page Count: 15  Doc: Ethernet  OrgName: NHS-973-1-YS-1M51  (hidden comment: TitleBlock0N)  (graphical)
C17  N.C.  [C0603]
C18  0.1uF  [C0603]
C19  0.01uF  [C0603]
C20  0.1uF  [C0603]
C21  0.01uF  [C0603]
C22  7pF  [C0603]
C23  7pF  [C0603]
C24  0.01uF  [C0603]
C25  0.01uF/2KV  [CK05]
CB28  0.1uF  [C0603]
CB29  0.1uF  [C0603]
CON26  RJ-45 8P8C_LED R/A  [RJ45\8P\JA\LED]
CT70  10uF  [C0603]
CT71  10uF  [C0603]
CT72  10uF  [C0603]
CT73  10uF  [C0603]
CT74  10uF  [C0603]
L6  1608-221T  [L0603]
L7  1608-221T  [L0603]
R53  6.19K +/-1%  [R0603]
R54  0  [R0603]
R55  5.1K  [R0603]
R56  5.1K  [R0603]
R57  N.C.  [R0603]
R58  N.C.  [R0603]
R59  10K  [R0603]
R60  N.C.  [R0603]
R61  10K  [R0603]
R62  N.C.  [R0603]
R63  N.C.  [R0603]
R64  5.1K  [R0603]
R65  1K  [R0603]
R66  1K  [R0603]
R67  1M  [R0603]
R68  330  [R0603]
R69  75  [R0603]
R70  5.1K  [R0603]
R71  75  [R0603]
R72  5.1K  [R0603]
R73  75  [R0603]
R74  75  [R0603]
SW17  Ethernet  [DIPSWx5_2.54mm]
SW18  Ethernet  [DIPSWx5_2.54mm]
U9  IP101GR  [QFN32]
U10  TS8121C  [ST6200T]
X3  25MHz  [SOT-143]

### Ports
nRst (in), PF[0..9] (in)

### Nets
PhyAVD33: CB28.2 CT73.1 L7.2 U9.31(AVD33)
PhyIOVD33: CT71.1 L6.2 R55.2 R56.2 R57.2 R59.2 R61.2 R63.2 U9.13(IOVDD)
RegOut: CB29.2 CT74.1 U9.28(RegOut)
VD33: CT70.1 CT72.1 L6.1 L7.1 R65.1 R70.1
VS: C17.2 C18.2 C19.2 C20.2 C21.2 C22.2 C23.2 C24.2 C25.2 CB28.1 CB29.1 CON26.11(LED-) CON26.13(Shield) CON26.14(Shield) CT70.2 CT71.2 CT72.2 CT73.2 CT74.2 R53.1 R58.1 R60.1 R62.1 R64.1 R72.2 U9.33(EPad) X3.2(GND) X3.4(GND)
50MClki: C17.1 R54.2 U9.10(TxClk/50MClki)
Col: R59.1 R60.2 U9.4(Col/RMII)
CRS: R61.1 R62.2 U9.20(CRS/LEDMod)
EthX0: C23.1 R67.1 R68.2 U9.3(Xo)
EthX1: C22.1 R67.2 U9.2(Xi) X3.1(XIN)
MDI_RN: U9.26(MDiRn) U10.8(RD-)
MDI_RP: U9.27(MDiRp) U10.6(RD+)
MDI_TN: U9.29(MDiTn) U10.3(TD-)
MDI_TP: U9.30(MDiTp) U10.1(TD+)
nRst: U9.32(nRst)
PF0: SW17.1(A1)
PF1: SW17.2(A2)
PF2: SW17.3(A3)
PF3: SW17.4(A4)
PF4: SW17.5(A5)
PF5: SW18.1(A1)
PF6: SW18.2(A2)
PF7: SW18.3(A3)
PF8: SW18.4(A4)
PF9: SW18.5(A5)
PhyAD0: CON26.9(LED-) R70.2 U9.11(LED0/PhyAD0)
PhyAD3: R66.1 R72.1 U9.12(LED3/PhyAD3)
PhyTest: R57.1 R58.2 U9.24(TestOn)
RMii0CRSDV: R63.1 R64.2 SW18.7(B4) U9.19(RxDV/CRS_DV)
RMii0MDC: SW17.10(B1) U9.22(MDC)
RMii0MDio: R55.1 SW17.9(B2) U9.23(MDIO)
RMii0RefClk: R54.1 SW18.10(B1) U9.14(RxClk/50M_Clko)
RMii0RxD0: SW18.9(B2) U9.18(RxD0)
RMii0RxD1: SW18.8(B3) U9.17(RxD1)
RMii0TxD0: SW17.8(B3) U9.9(TxD0)
RMii0TxD1: SW17.7(B4) U9.8(TxD1)
RMii0TxEn: SW17.6(B5) U9.5(TxEn)
RMiiRxErr: R56.1 SW18.6(B5) U9.21(RxEr/Int32)
RX+: CON26.3(RX+) U10.11(RX+)
RX-: CON26.6(RX-) U10.9(RX-)
TX+: CON26.1(TX+) U10.16(TX+)
TX-: CON26.2(TX-) U10.14(TX-)
NetC18_1: C18.1 C19.1 U10.2(CT)
NetC20_1: C20.1 C21.1 U10.7(CT)
NetC24_1: C24.1 C25.1 R69.1 R71.1 R73.1 R74.1
NetCON26_4: CON26.4(NC) CON26.5(NC) R71.2
NetCON26_7: CON26.7(NC) CON26.8(NC) R69.2
NetCON26_10: CON26.10(LED+) R65.2
NetCON26_12: CON26.12(LED+) R66.2
NetR53_2: R53.2 U9.25(Iset)
NetR68_1: R68.1 X3.3(XOUT)
NetR73_2: R73.2 U10.10(CT)
NetR74_2: R74.2 U10.15(CT)

Not connected (* = marked no-connect by the designer): U9 1(TxEr/FxSD) 6(TxD3) 7(TxD2) 15(RxD3) 16(RxD2); U10 4(NC) 5(NC) 12(NC) 13(NC)

### Notes on the sheet
- EthernetT Port0
- (in symbol TitleBlock0N) Size; Document Number; Rev; Date:; Sheet; of

### Library data of the parts
C17-C25 CB28 CB29 CT70-CT74 = CAP NP
CON26 = RJ45_SHLD_0
L6 L7 = INDUCTOR
R53-R74 = R
SW17 SW18 = SW DIP-5_0
U9 = IP101GA_0
U10 = PE-68515_1
X3 = Crystal_SMD_2: Vendor: Aurum
*#7 = TitleBlock0N: Page Create Date: April 25, 1995

## Sheet EBI, GPIO.SchDoc
size 260 x 200 mm
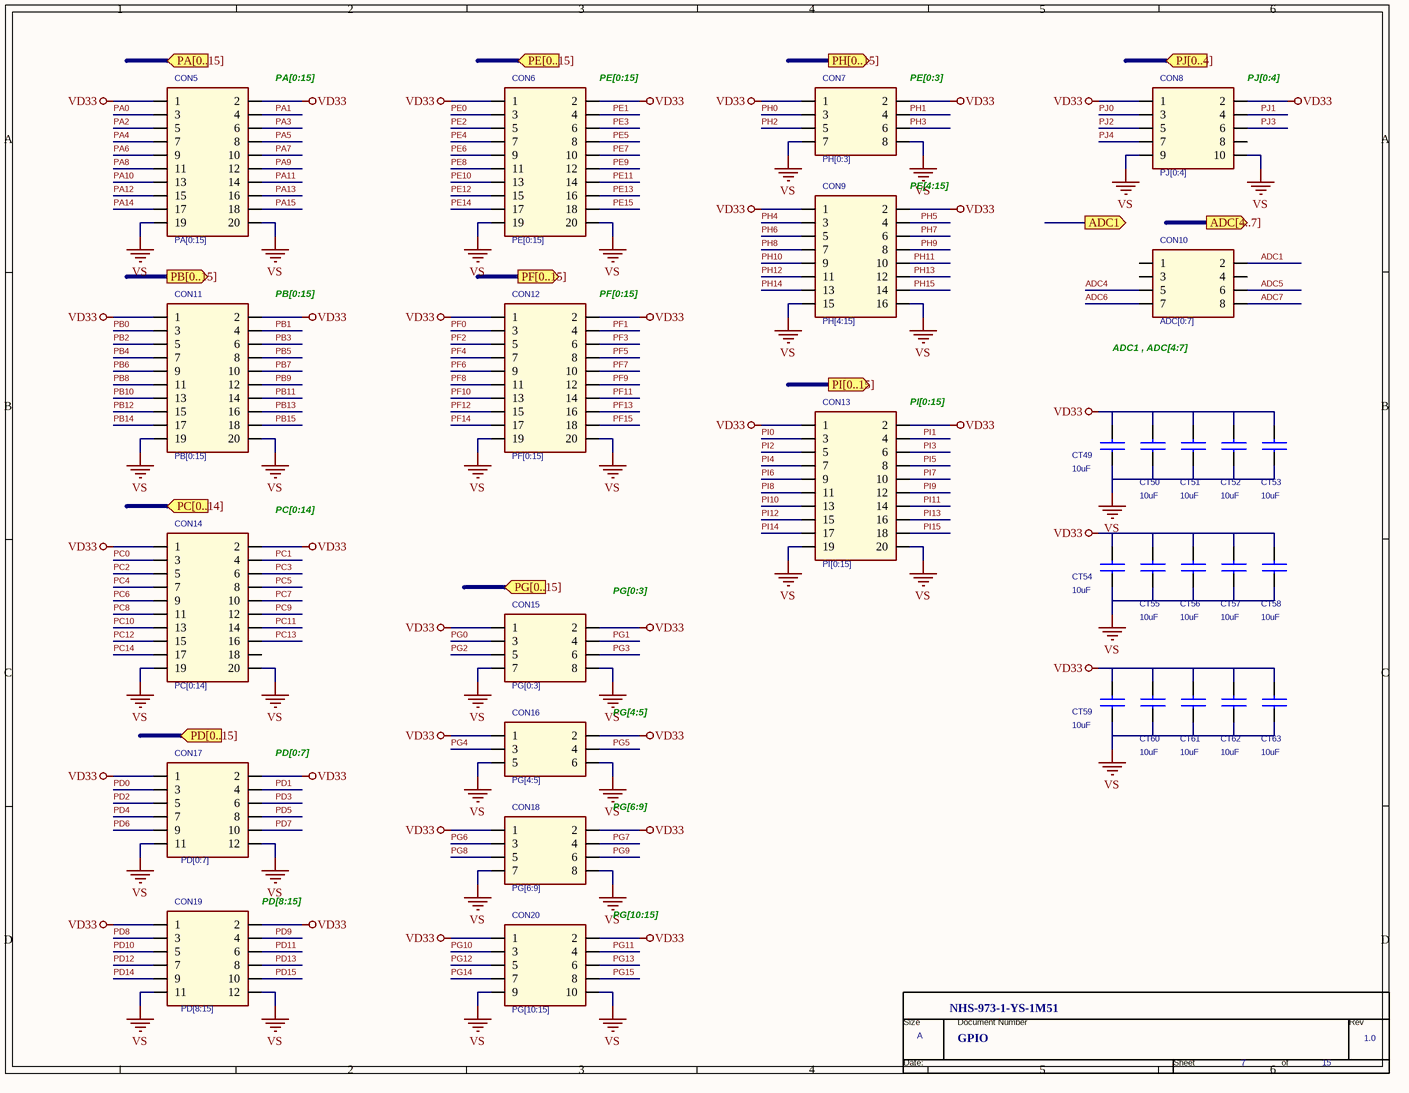
[diagram p7: EBI, GPIO.SchDoc]

### Parts
(Parts that share a designator on the sheet are numbered #1, #2 ... from top to bottom, then left to right.)
*#8  RevCode: 1.0  Page Size: A  Page Number: 7  Page Count: 15  Doc: GPIO  OrgName: NHS-973-1-YS-1M51  (hidden comment: TitleBlock0N)  (graphical)
CON5  PA[0:15]  [Header_2x10_2.54mm]
CON6  PE[0:15]  [Header_2x10_2.54mm]
CON7  PH[0:3]  [Header_2x4_2.54mm]
CON8  PJ[0:4]  [Header_2x5_2.54mm]
CON9  PH[4:15]  [header_2x8_2.54mm]
CON10  ADC[0:7]  [Header_2x4_2.54mm]
CON11  PB[0:15]  [Header_2x10_2.54mm]
CON12  PF[0:15]  [Header_2x10_2.54mm]
CON13  PI[0:15]  [Header_2x10_2.54mm]
CON14  PC[0:14]  [Header_2x10_2.54mm]
CON15  PG[0:3]  [Header_2x4_2.54mm]
CON16  PG[4:5]  [Header_2x3_2.54mm]
CON17  PD[0:7]  [Header_2x6_2.54mm]
CON18  PG[6:9]  [Header_2x4_2.54mm]
CON19  PD[8:15]  [Header_2x6_2.54mm]
CON20  PG[10:15]  [Header_2x5_2.54mm]
CT49  10uF  [C0603]
CT50  10uF  [C0603]
CT51  10uF  [C0603]
CT52  10uF  [C0603]
CT53  10uF  [C0603]
CT54  10uF  [C0603]
CT55  10uF  [C0603]
CT56  10uF  [C0603]
CT57  10uF  [C0603]
CT58  10uF  [C0603]
CT59  10uF  [C0603]
CT60  10uF  [C0603]
CT61  10uF  [C0603]
CT62  10uF  [C0603]
CT63  10uF  [C0603]

### Ports
ADC1 (out), ADC[4..7] (out), PA[0..15] (in), PB[0..15] (out), PC[0..14] (in), PD[0..15] (in), PE[0..15] (in), PF[0..15] (out), PG[0..15] (in), PH[0..15] (out), PI[0..15] (out), PJ[0..4] (in)

### Nets
VD33: CON5.1 CON5.2 CON6.1 CON6.2 CON7.1 CON7.2 CON8.1 CON8.2 CON9.1 CON9.2 CON11.1 CON11.2 CON12.1 CON12.2 CON13.1 CON13.2 CON14.1 CON14.2 CON15.1 CON15.2 CON16.1 CON16.2 CON17.1 CON17.2 CON18.1 CON18.2 CON19.1 CON19.2 CON20.1 CON20.2 CT49.2 CT50.2 CT51.2 CT52.2 CT53.2 CT54.2 CT55.2 CT56.2 CT57.2 CT58.2 CT59.2 CT60.2 CT61.2 CT62.2 CT63.2
VS: CON5.19 CON5.20 CON6.19 CON6.20 CON7.7 CON7.8 CON8.9 CON8.10 CON9.15 CON9.16 CON11.19 CON11.20 CON12.19 CON12.20 CON13.19 CON13.20 CON14.19 CON14.20 CON15.7 CON15.8 CON16.5 CON16.6 CON17.11 CON17.12 CON18.7 CON18.8 CON19.11 CON19.12 CON20.9 CON20.10 CT49.1 CT50.1 CT51.1 CT52.1 CT53.1 CT54.1 CT55.1 CT56.1 CT57.1 CT58.1 CT59.1 CT60.1 CT61.1 CT62.1 CT63.1
ADC1: CON10.2
ADC4: CON10.5
ADC5: CON10.6
ADC6: CON10.7
ADC7: CON10.8
PA0: CON5.3
PA1: CON5.4
PA2: CON5.5
PA3: CON5.6
PA4: CON5.7
PA5: CON5.8
PA6: CON5.9
PA7: CON5.10
PA8: CON5.11
PA9: CON5.12
PA10: CON5.13
PA11: CON5.14
PA12: CON5.15
PA13: CON5.16
PA14: CON5.17
PA15: CON5.18
PB0: CON11.3
PB1: CON11.4
PB2: CON11.5
PB3: CON11.6
PB4: CON11.7
PB5: CON11.8
PB6: CON11.9
PB7: CON11.10
PB8: CON11.11
PB9: CON11.12
PB10: CON11.13
PB11: CON11.14
PB12: CON11.15
PB13: CON11.16
PB14: CON11.17
PB15: CON11.18
PC0: CON14.3
PC1: CON14.4
PC2: CON14.5
PC3: CON14.6
PC4: CON14.7
PC5: CON14.8
PC6: CON14.9
PC7: CON14.10
PC8: CON14.11
PC9: CON14.12
PC10: CON14.13
PC11: CON14.14
PC12: CON14.15
PC13: CON14.16
PC14: CON14.17
PD0: CON17.3
PD1: CON17.4
PD2: CON17.5
PD3: CON17.6
PD4: CON17.7
PD5: CON17.8
PD6: CON17.9
PD7: CON17.10
PD8: CON19.3
PD9: CON19.4
PD10: CON19.5
PD11: CON19.6
PD12: CON19.7
PD13: CON19.8
PD14: CON19.9
PD15: CON19.10
PE0: CON6.3
PE1: CON6.4
PE2: CON6.5
PE3: CON6.6
PE4: CON6.7
PE5: CON6.8
PE6: CON6.9
PE7: CON6.10
PE8: CON6.11
PE9: CON6.12
PE10: CON6.13
PE11: CON6.14
PE12: CON6.15
PE13: CON6.16
PE14: CON6.17
PE15: CON6.18
PF0: CON12.3
PF1: CON12.4
PF2: CON12.5
PF3: CON12.6
PF4: CON12.7
PF5: CON12.8
PF6: CON12.9
PF7: CON12.10
PF8: CON12.11
PF9: CON12.12
PF10: CON12.13
PF11: CON12.14
PF12: CON12.15
PF13: CON12.16
PF14: CON12.17
PF15: CON12.18
PG0: CON15.3
PG1: CON15.4
PG2: CON15.5
PG3: CON15.6
PG4: CON16.3
PG5: CON16.4
PG6: CON18.3
PG7: CON18.4
PG8: CON18.5
PG9: CON18.6
PG10: CON20.3
PG11: CON20.4
PG12: CON20.5
PG13: CON20.6
PG14: CON20.7
PG15: CON20.8
PH0: CON7.3
PH1: CON7.4
PH2: CON7.5
PH3: CON7.6
PH4: CON9.3
PH5: CON9.4
PH6: CON9.5
PH7: CON9.6
PH8: CON9.7
PH9: CON9.8
PH10: CON9.9
PH11: CON9.10
PH12: CON9.11
PH13: CON9.12
PH14: CON9.13
PH15: CON9.14
PI0: CON13.3
PI1: CON13.4
PI2: CON13.5
PI3: CON13.6
PI4: CON13.7
PI5: CON13.8
PI6: CON13.9
PI7: CON13.10
PI8: CON13.11
PI9: CON13.12
PI10: CON13.13
PI11: CON13.14
PI12: CON13.15
PI13: CON13.16
PI14: CON13.17
PI15: CON13.18
PJ0: CON8.3
PJ1: CON8.4
PJ2: CON8.5
PJ3: CON8.6
PJ4: CON8.7

Not connected (* = marked no-connect by the designer): CON8 8; CON10 1 3 4; CON14 18

### Notes on the sheet
- (near CON5) PA[0:15]
- (near CON6) PE[0:15]
- (near CON7) PE[0:3]
- (near CON8) PJ[0:4]
- (near CON9) PE[4:15]
- (near CON11) PB[0:15]
- (near CON12) PF[0:15]
- (near CON10) ADC1 , ADC[4:7]
- (near CON13) PI[0:15]
- (near CON14) PC[0:14]
- (near CON15) PG[0:3]
- (near CON17) PD[0:7]
- PG[4:5]
- PG[6:9]
- (near CON19) PD[8:15]
- PG[10:15]
- (in symbol TitleBlock0N) Size; Document Number; Rev; Date:; Sheet; of

### Library data of the parts
CON5 CON6 CON11-CON14 = CON20A
CON7 CON10 = CON8A
CON8 = CON10A
CON9 = CON16A
CON15 = CON8A_2
CON16 = CON6A_1
CON17 CON19 = CON12A
CON18 = CON8A_3
CON20 = CON10A_1
CT49-CT63 = CAP NP
*#8 = TitleBlock0N: Page Create Date: April 25, 1995

## Sheet IIS.SchDoc
size 240 x 169 mm
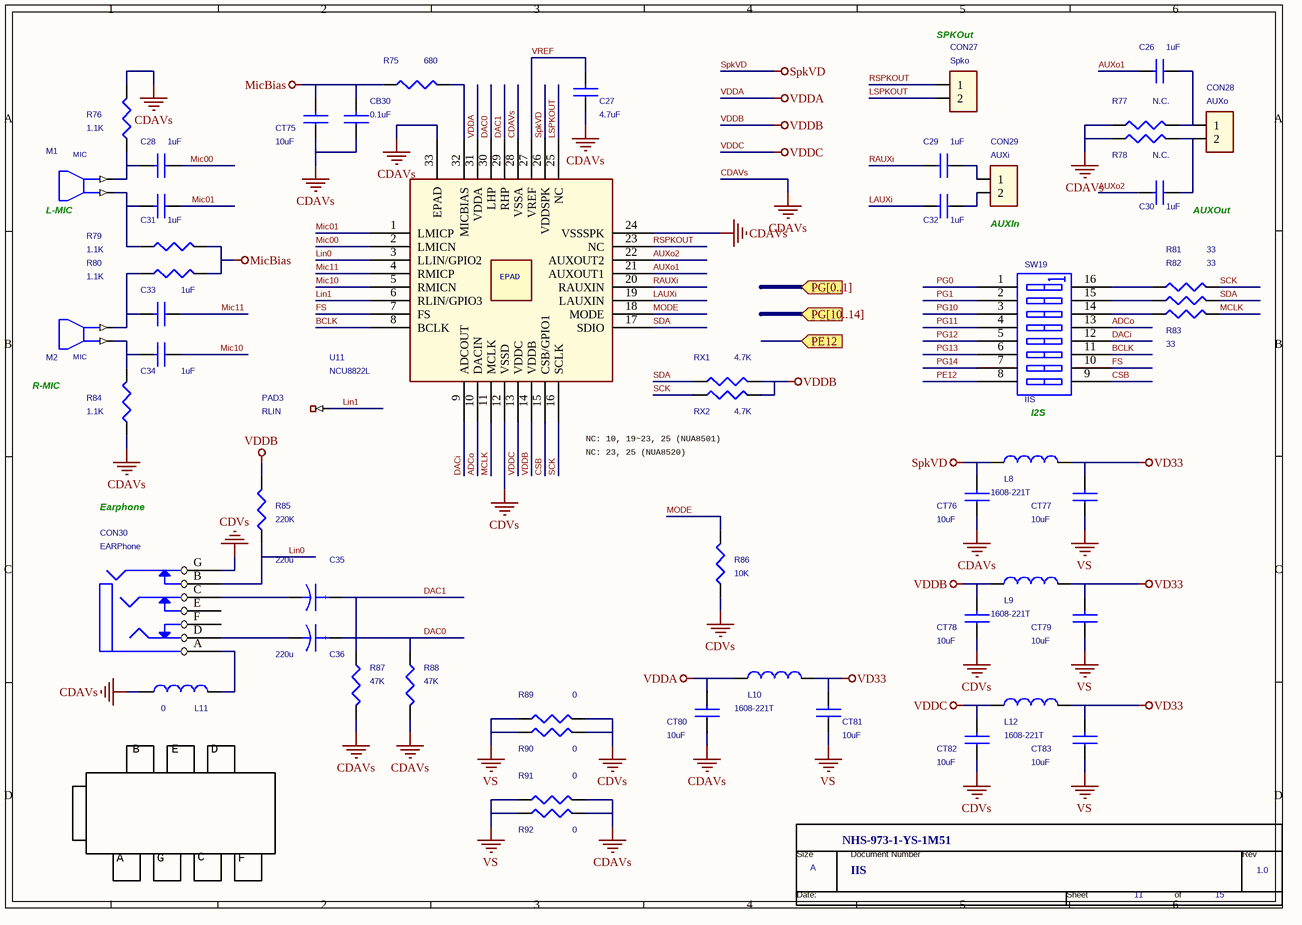
[diagram p8: IIS.SchDoc]

### Parts
(Parts that share a designator on the sheet are numbered #1, #2 ... from top to bottom, then left to right.)
*#9  RevCode: 1.0  Page Size: A  Page Number: 11  Page Count: 15  Doc: IIS  OrgName: NHS-973-1-YS-1M51  (hidden comment: TitleBlock0N)  (graphical)
C26  1uF  [C0603]
C27  4.7uF  [C0603]
C28  1uF  [C0603]
C29  1uF  [C0603]
C30  1uF  [C0603]
C31  1uF  [C0603]
C32  1uF  [C0603]
C33  1uF  [C0603]
C34  1uF  [C0603]
C35  220u  [CAP_B]
C36  220u  [CAP_B]
CB30  0.1uF  [C0603]
CON27  Spko  [Header_2x1_2.54mm]
CON28  AUXo  [Header_2x1_2.54mm]
CON29  AUXi  [Header_2x1_2.54mm]
CON30  EARPhone  [PHONE-PJK-631]
CT75  10uF  [C0603]
CT76  10uF  [C0603]
CT77  10uF  [C0603]
CT78  10uF  [C0603]
CT79  10uF  [C0603]
CT80  10uF  [C0603]
CT81  10uF  [C0603]
CT82  10uF  [C0603]
CT83  10uF  [C0603]
L8  1608-221T  [L0603]
L9  1608-221T  [L0603]
L10  1608-221T  [L0603]
L11  0  [L0603]
L12  1608-221T  [L0603]
M1  MIC  [9.7D2.54mm]
M2  MIC  [9.7D2.54mm]
PAD3  RLIN  [1PAD 1.25x1.25mm]
R75  680  [R0603]
R76  1.1K  [R0603]
R77  N.C.  [R0603]
R78  N.C.  [R0603]
R79  1.1K  [R0603]
R80  1.1K  [R0603]
R81  33  [R0603]
R82  33  [R0603]
R83  33  [R0603]
R84  1.1K  [R0603]
R85  220K  [R0603]
R86  10K  [R0603]
R87  47K  [R0603]
R88  47K  [R0603]
R89  0  [R0603]
R90  0  [R0603]
R91  0  [R0603]
R92  0  [R0603]
RX1  4.7K  [R0603]
RX2  4.7K  [R0603]
SW19  IIS  [DIPSWx8_2.54mm]
U11  NCU8822L  [QFN 32L, 5mm X 5mm, 0.5mm lead pitch]

### Ports
PE12 (in), PG[0..1] (in), PG[10..14] (in)

### Nets
CDAVs: C27.1 CB30.1 CT75.1 CT76.1 CT80.1 L11.1 R76.2 R77.1 R78.1 R84.1 R87.2 R88.2 R91.1 R92.1 U11.24(VSSSPK) U11.28(VSSA) U11.33(EPAD)
CDVs: CON30.G CT78.1 CT82.1 R86.1 R89.1 R90.1 U11.12(VSSD)
MicBias: CB30.2 CT75.2 R75.2 R79.2 R80.2
SpkVD: CT76.2 L8.1 U11.26(VDDSPK)
VD33: CT77.2 CT79.2 CT81.2 CT83.2 L8.2 L9.2 L10.2 L12.2
VDDA: CT80.2 L10.1 U11.31(VDDA)
VDDB: CT78.2 L9.1 R85.2 RX1.1 RX2.1 U11.14(VDDB)
VDDC: CT82.2 L12.1 U11.13(VDDC)
VS: CT77.1 CT79.1 CT81.1 CT83.1 R89.2 R90.2 R91.2 R92.2
ADCo: SW19.13(B4) U11.10(DACIN)
AUXo1: C26.2 U11.21(AUXOUT1)
AUXo2: C30.2 U11.22(AUXOUT2)
BCLK: SW19.11(B6) U11.8(BCLK)
CSB: SW19.9(B8) U11.15(CSB/GPIO1)
DAC0: C36.1 R88.1 U11.30(LHP)
DAC1: C35.1 R87.1 U11.29(RHP)
DACi: SW19.12(B5) U11.9(ADCOUT)
FS: SW19.10(B7) U11.7(FS)
LAUXi: C32.2 U11.19(LAUXIN)
Lin0: CON30.B R85.1 U11.3(LLIN/GPIO2)
Lin1: PAD3.\ U11.6(RLIN/GPIO3)
LSPKOUT: CON27.2 U11.25(NC)
MCLK: R83.1 U11.11(MCLK)
Mic00: C28.1 U11.2(LMICN)
Mic01: C31.1 U11.1(LMICP)
Mic10: C34.1 U11.5(RMICN)
Mic11: C33.1 U11.4(RMICP)
MODE: R86.2 U11.18(MODE)
PE12: SW19.8(A8)
PG0: SW19.1(A1)
PG1: SW19.2(A2)
PG10: SW19.3(A3)
PG11: SW19.4(A4)
PG12: SW19.5(A5)
PG13: SW19.6(A6)
PG14: SW19.7(A7)
RAUXi: C29.2 U11.20(RAUXIN)
RSPKOUT: CON27.1 U11.23(NC)
SCK: R81.1 RX2.2 U11.16(SCLK)
SDA: R82.1 RX1.2 U11.17(SDIO)
VREF: C27.2 U11.27(VREF)
NetC26_1: C26.1 CON28.1 R77.2
NetC28_2: C28.2 M1.2 R76.1
NetC29_1: C29.1 CON29.1
NetC30_1: C30.1 CON28.2 R78.2
NetC31_2: C31.2 M1.1 R79.1
NetC32_1: C32.1 CON29.2
NetC33_2: C33.2 M2.1 R80.1
NetC34_2: C34.2 M2.2 R84.2
NetC35_2: C35.2 CON30.C
NetC36_2: C36.2 CON30.D
NetCON30_A: CON30.A L11.2
NetR75_1: R75.1 U11.32(MICBIAS)
NetR81_2: R81.2 SW19.16(B1)
NetR82_2: R82.2 SW19.15(B2)
NetR83_2: R83.2 SW19.14(B3)

Not connected (* = marked no-connect by the designer): CON30 E F

### Notes on the sheet
- (near CON27) SPKOut
- (near M1) L-MIC
- AUXIn
- (near C30) AUXOut
- R-MIC
- NC: 23, 25 (NUA8520)
- NC: 10, 19~23, 25 (NUA8501)
- I2S
- Earphone
- (near L11) B
- (near L11) E
- (near L11) D
- A
- G
- C
- F
- (in symbol CAP-T) +
- (in symbol TitleBlock0N) Size; Document Number; Rev; Date:; Sheet; of

### Library data of the parts
C26-C34 CB30 CT75-CT83 = CAP NP
C35 C36 = CAP-T
CON27-CON29 = CON2
CON30 = PHONEJACK STEREO SW PJK-634_4: Vendor: 翬礨; Package: PHONE-PJK-631
L8-L12 = INDUCTOR
M1 M2 = MICROPHONE_0
PAD3 = 1PAD
R75-R92 RX1 RX2 = R
SW19 = SW DIP-8
U11 = NAU8501
*#9 = TitleBlock0N: Page Create Date: April 25, 1995

## Nets that join several sheets
5Vin: USB (7 pins), SysPower (5 pins)
VD12: P_Filter (18 pins), SysPower (CT3.1 R9.2)
VD18: P_Filter (8 pins), SysPower (CT4.1 R10.2)
VD33: 2ns RMII (6 pins), Memory (15 pins), USB (10 pins), P_Filter (20 pins), SysPower (7 pins), 1st RMII (6 pins), EBI, GPIO (45 pins), IIS (8 pins)
VS: 2ns RMII (28 pins), Memory (21 pins), USB (26 pins), P_Filter (43 pins), SysPower (25 pins), 1st RMII (28 pins), EBI, GPIO (45 pins), IIS (8 pins)